# Altium schematic sheet V1_pwr_sply_sch.SchDoc
size A4; SheetNumber: 3; SheetTotal: 6; SPICEModelCacheFDQRRNLS: <root> / <DocumentId>FDQRRNLS</DocumentId> / <CacheFrame Number="0"> / <Model Name="875115552001_68uf" Kind="CKT"> / <Text>******* / .subckt 875115552001_68uF 1 2 / Rser 1 3 0.0109015046691 / Lser 2 4 4.507783507E-09 / C1 3 4 0.000068 / Rpar 3 4 73529.4117647059 / .ends 875115552001_68uF</Text> / </Model> / <Model Name="0805_885012107018_4.7uf" Kind="CKT"> / <Text>******* / .subckt 0805_885012107018_4.7uF 1 2 / Rser 1 3 0.00349429730952 / Lser 2 4 2.52123218E-10 / C1 3 4 0.0000047 / Rpar 3 4 20000000 / .ends 0805_885012107018_4.7uF</Text> / </Model> / <Model Name="0805_885012207076_470nf" Kind="CKT"> / <Text>******* / .subckt 0805_885012207076_470nF 1 2 / Rser 1 3 0.00781019032257 / Lser 2 4 0.00000000049 / C1 3 4 0.00000047 / Rpar 3 4 1100000000 / .ends 0805_885012207076_470nF</Text> / </Model> / <Model Name="6060_74439346100_10u" Kind="CKT"> / <Text>******* / .subckt 6060_74439346100_10u 1 2 / Rp 1 2 9786 / Cp 1 2 8.192p / Rs 1 N3 0.0265 / L1 N3 2 9.539u / .ends 6060_74439346100_10u</Text> / </Model> / </CacheFrame> / </root>
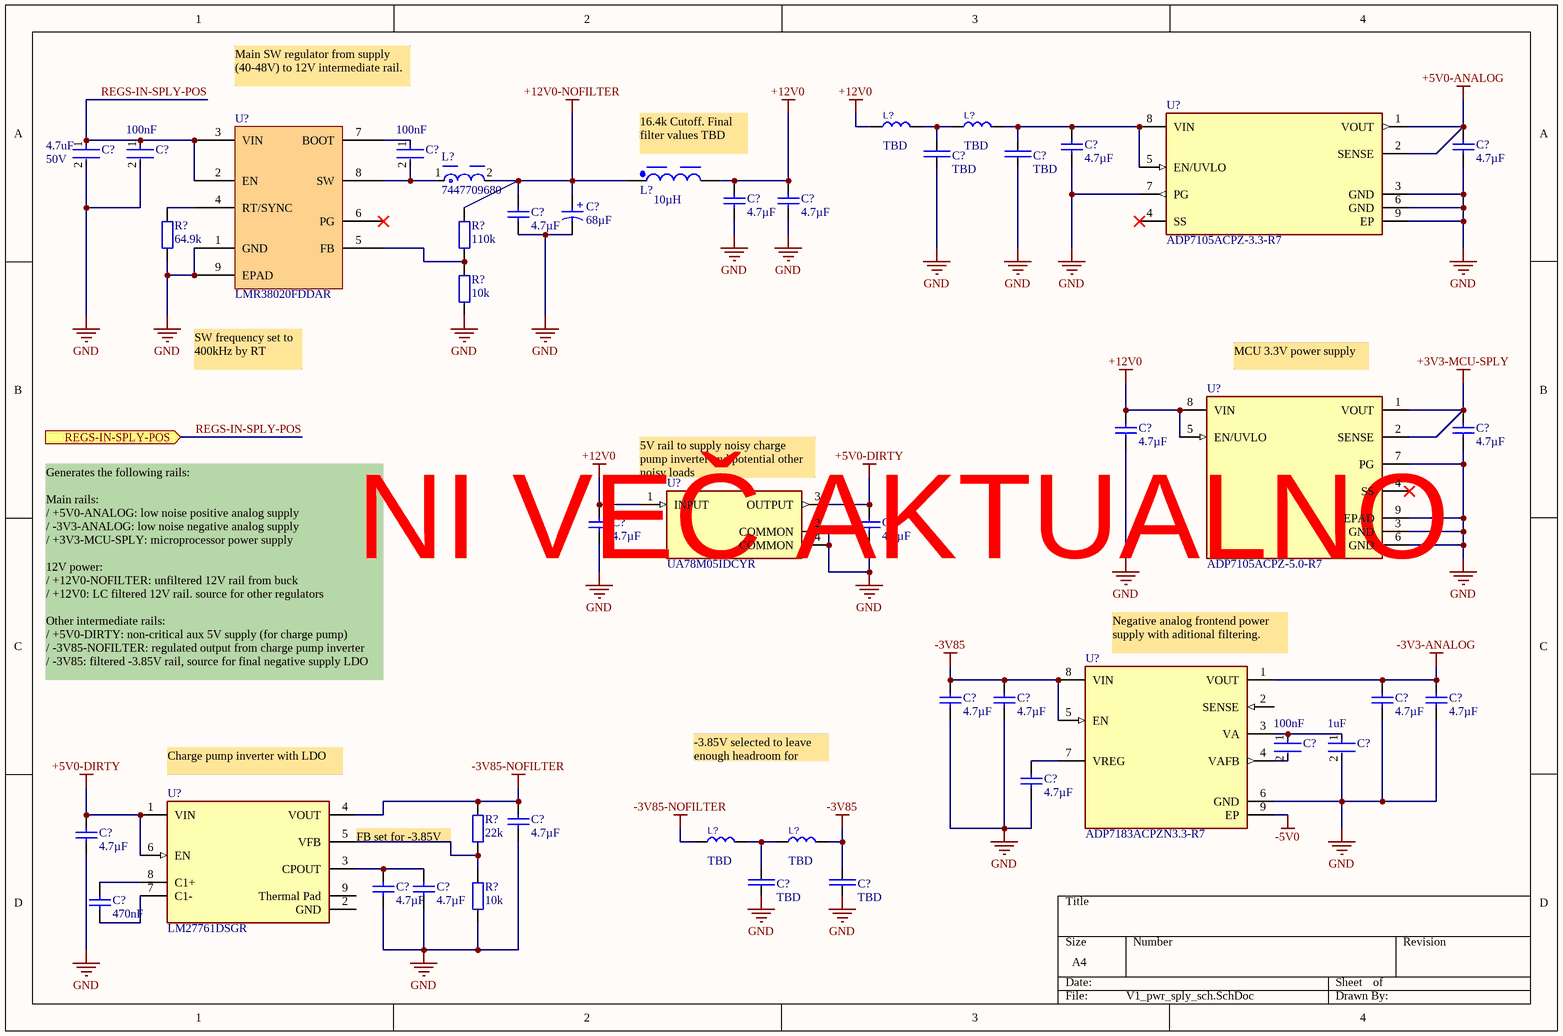
[diagram p0: V1_pwr_sply_sch.SchDoc]

## Parts
(Parts that share a designator on the sheet are numbered #1, #2 ... from top to bottom, then left to right.)
C?#1  Voltage Rating (DC): 50V  Capacitance: 4.7uF  [FP-885012208094-IPC_B]  (hidden comment: 885012208094)
C?#2  Capacitance: 100nF  [FP-885012206095-IPC_B]  (hidden comment: 885012206095)
C?#3  Capacitance: 100nF  [FP-885012206095-IPC_B]  (hidden comment: 885012206095)
C?#4  value TBD  [FPR_0603_C_R0]  (hidden comment: PN_C0603_TBD)
C?#5  value TBD  [FPR_0603_C_R0]  (hidden comment: PN_C0603_TBD)
C?#6  Capacitance: 4.7µF  [WCAP-CSGP_0805_L2W1.25H1.25]  (hidden comment: 885012107018)
C?#7  Capacitance: 4.7µF  [WCAP-CSGP_0805_L2W1.25H1.25]  (hidden comment: 885012107018)
C?#8  Capacitance: 68µF  [WCAP-PSHP_D8H8.7]  (hidden comment: 875115552001)
C?#9  Capacitance: 4.7µF  [WCAP-CSGP_0805_L2W1.25H1.25]  (hidden comment: 885012107018)
C?#10  Capacitance: 4.7µF  [WCAP-CSGP_0805_L2W1.25H1.25]  (hidden comment: 885012107018)
C?#11  Capacitance: 4.7µF  [WCAP-CSGP_0805_L2W1.25H1.25]  (hidden comment: 885012107018)
C?#12  Capacitance: 4.7µF  [WCAP-CSGP_0805_L2W1.25H1.25]  (hidden comment: 885012107018)
C?#13  Capacitance: 4.7µF  [WCAP-CSGP_0805_L2W1.25H1.25]  (hidden comment: 885012107018)
C?#14  Capacitance: 4.7µF  [WCAP-CSGP_0805_L2W1.25H1.25]  (hidden comment: 885012107018)
C?#15  Capacitance: 4.7µF  [WCAP-CSGP_0805_L2W1.25H1.25]  (hidden comment: 885012107018)
C?#16  Capacitance: 4.7µF  [WCAP-CSGP_0805_L2W1.25H1.25]  (hidden comment: 885012107018)
C?#17  Capacitance: 4.7µF  [WCAP-CSGP_0805_L2W1.25H1.25]  (hidden comment: 885012107018)
C?#18  Capacitance: 4.7µF  [WCAP-CSGP_0805_L2W1.25H1.25]  (hidden comment: 885012107018)
C?#19  Capacitance: 4.7µF  [WCAP-CSGP_0805_L2W1.25H1.25]  (hidden comment: 885012107018)
C?#20  Capacitance: 100nF  [FP-885012206095-IPC_B]  (hidden comment: 885012206095)
C?#21  Capacitance: 1uF  [FP-885012207078-IPC_B]  (hidden comment: 885012207078)
C?#22  Capacitance: 4.7µF  [WCAP-CSGP_0805_L2W1.25H1.25]  (hidden comment: 885012107018)
C?#23  Capacitance: 4.7µF  [WCAP-CSGP_0805_L2W1.25H1.25]  (hidden comment: 885012107018)
C?#24  Capacitance: 4.7µF  [WCAP-CSGP_0805_L2W1.25H1.25]  (hidden comment: 885012107018)
C?#25  value TBD  [FPR_0603_C_R0]  (hidden comment: PN_C0603_TBD)
C?#26  value TBD  [FPR_0603_C_R0]  (hidden comment: PN_C0603_TBD)
C?#27  Capacitance: 4.7µF  [WCAP-CSGP_0805_L2W1.25H1.25]  (hidden comment: 885012107018)
C?#28  Capacitance: 4.7µF  [WCAP-CSGP_0805_L2W1.25H1.25]  (hidden comment: 885012107018)
C?#29  Capacitance: 470nF  [WCAP-CSGP_0805_L2W1.25H1.25]  (hidden comment: 885012207076)
L?#1  value TBD  (hidden comment: PN_L0805_TBD)
L?#2  value TBD  (hidden comment: PN_L0805_TBD)
L?#3  7447709680  [FP-7447709680-MFG]
L?#4  Inductance: 10µH  [WE-XHMI_6060_L6.65W6.45H5.8]  (hidden comment: 10µH, 5A)
L?#5  value TBD  (hidden comment: PN_L0805_TBD)
L?#6  value TBD  (hidden comment: PN_L0805_TBD)
R?#1  value 64.9k  [FPR_0603_R_R0]  (hidden comment: PN_R0603_64k9)
R?#2  value 110k  [FPR_0603_R_R0]  (hidden comment: PN_R0603_110k)
R?#3  value 10k  [FPR_0603_R_R0]  (hidden comment: PN_R0603_10k)
R?#4  value 22k  [FPR_0603_R_R0]  (hidden comment: PN_R0603_22k)
R?#5  value 10k  [FPR_0603_R_R0]  (hidden comment: PN_R0603_10k)
U?#1  ADP7105ACPZ-3.3-R7  [FP-CP-8-5-IPC_C]
U?#2  LMR38020FDDAR
U?#3  ADP7105ACPZ-5.0-R7  [FP-CP-8-5-IPC_B]
U?#4  UA78M05IDCYR  [FP-DCY0004A-MFG]
U?#5  ADP7183ACPZN3.3-R7  [FP-CP-8-27-IPC_B]
U?#6  LM27761DSGR  [FP-DSG0008A-IPC_B]

## Ports
REGS-IN-SPLY-POS (in)

## Nets
+3V3-MCU-SPLY: C?#13.2 U?#3.1(VOUT) U?#3.2(SENSE)
+5V0-ANALOG: C?#7.2 U?#1.1(VOUT) U?#1.2(SENSE)
+5V0-DIRTY: C?#15.2 C?#24.2 U?#4.3(OUTPUT) U?#6.1(VIN) U?#6.6(EN)
+12V0: C?#9.2 C?#10.2 C?#12.2 C?#14.2 L?#1.1 L?#4.2 U?#3.5(EN/UVLO) U?#3.8(VIN) U?#4.1(INPUT)
+12V0-NOFILTER: C?#8.1(P) C?#11.2 L?#3.2 L?#4.1 R?#2.2
-3V3-ANALOG: C?#18.2 C?#19.2 U?#5.1(VOUT)
-3V85: C?#16.2 C?#17.2 C?#26.1 L?#6.2 U?#5.5(EN) U?#5.8(VIN)
-3V85-NOFILTER: C?#22.1 L?#5.1 R?#4.2 U?#6.4(VOUT)
-5V0: U?#5.9(EP)
GND: C?#1.2 C?#2.2 C?#4.1 C?#5.1 C?#6.1 C?#7.1 C?#8.2(N) C?#9.1 C?#10.1 C?#11.1 C?#12.1 C?#13.1 C?#14.1 C?#15.1 C?#16.1 C?#17.1 C?#18.1 C?#19.1 C?#21.2 C?#22.2 C?#23.1 C?#24.1 C?#25.2 C?#26.2 C?#27.1 C?#28.1 R?#1.1 R?#3.1 R?#5.1 U?#1.3(GND) U?#1.6(GND) U?#1.7(PG) U?#1.9(EP) U?#2.1(GND) U?#2.9(EPAD) U?#3.3(GND) U?#3.6(GND) U?#3.7(PG) U?#3.9(EPAD) U?#4.2(COMMON) U?#4.4(COMMON) U?#5.6(GND)
REGS-IN-SPLY-POS: C?#1.1 C?#2.1 U?#2.2(EN) U?#2.3(VIN) ; port REGS-IN-SPLY-POS
NetC?#3_1: C?#3.1 U?#2.7(BOOT)
NetC?#3_2: C?#3.2 L?#3.1 U?#2.8(SW)
NetC?#4_2: C?#4.2 L?#1.2 L?#2.1
NetC?#5_2: C?#5.2 C?#6.2 L?#2.2 U?#1.5(EN/UVLO) U?#1.8(VIN)
NetC?#20_1: C?#20.1 C?#21.1 U?#5.3(VA)
NetC?#20_2: C?#20.2 U?#5.4(VAFB)
NetC?#23_2: C?#23.2 U?#5.7(VREG)
NetC?#25_1: C?#25.1 L?#5.2 L?#6.1
NetC?#27_2: C?#27.2 C?#28.2 U?#6.3(CPOUT)
NetC?#29_1: C?#29.1 U?#6.7(C1-)
NetC?#29_2: C?#29.2 U?#6.8(C1+)
NetR?#1_2: R?#1.2 U?#2.4(RT/SYNC)
NetR?#2_1: R?#2.1 R?#3.2 U?#2.5(FB)
NetR?#4_1: R?#4.1 R?#5.2 U?#6.5(VFB)

Not connected (* = marked no-connect by the designer): U?#1 4(SS)*; U?#2 6(PG)*; U?#3 4(SS)*; U?#5 2(SENSE); U?#6 2(GND) 9(Thermal_Pad)

## Notes on the sheet
- Main SW regulator from supply (40-48V) to 12V intermediate rail.
- 16.4k Cutoff. Final filter values TBD
- SW frequency set to 400kHz by RT
- (near U?#3) MCU 3.3V power supply
- (near U?#3) NI VEČ AKTUALNO
- (near U?#4) 5V rail to supply noisy charge pump inverter and potential other noisy loads
- (near U?#5) Negative analog frontend power supply with aditional filtering.
- Generates the following rails:
  Main rails:
  / +5V0-ANALOG: low noise positive analog supply
  / -3V3-ANALOG: low noise negative analog supply
  / +3V3-MCU-SPLY: microprocessor power supply
  12V power:
  / +12V0-NOFILTER: unfiltered 12V rail from buck
  / +12V0: LC filtered 12V rail. source for other regulators
  Other intermediate rails:
  / +5V0-DIRTY: non-critical aux 5V supply (for charge pump)
  / -3V85-NOFILTER: regulated output from charge pump inverter
  / -3V85: filtered -3.85V rail, source for final negative supply LDO
- (near U?#6) Charge pump inverter with LDO
- -3.85V selected to leave enough headroom for charge pump LDO an -3.3V LDO
- FB set for -3.85V out
- (in symbol 875115552001) +

## Library data of the parts
C?#1 = CMP-207839-000019-1: CAP CER 4.7UF 50V X7R 1206; Tolerance: 10%; Mount: Surface Mount; Width: 0.063inch; Min Operating Temperature: -55°C; RoHS Compliant: Yes; Dielectric: X7R; Series: WCAP-CSGP; Case Code (Metric): 3216; Case/Package: 1206; Max Operating Temperature: 125°C; Thickness: 0.075inch; Packaging: Cut Tape; Length: 0.126inch; Voltage Rating: 50V; Case Code (Imperial): 1206
C?#2 C?#3 C?#20 = CMP-207839-000004-1: CAP CER 0.1UF 50V X7R 0603; Tolerance: 10%; RoHS Compliant: Yes; Thickness: 0.037inch; Voltage Rating: 50V; Packaging: Cut Tape; Dielectric: X7R; Series: WCAP-CSGP; Width: 0.031inch; Max Operating Temperature: 125°C; Min Operating Temperature: -55°C; Case/Package: 0603; Case Code (Metric): 1608; Case Code (Imperial): 0603; Length: 0.063inch; Mount: Surface Mount; Voltage Rating (DC): 50V
C?#4 C?#5 C?#25 C?#26 = C: Capacitor - generic SMD
C?#6 C?#7 C?#9-C?#19 C?#22-C?#24 C?#27 C?#28 = 885012107018: WCAP-CSGP Multilayer Ceramic Chip Capacitor, General Purpose, size 0805, X5R, 4.7µF, 25VDC; Manufacturer: Wurth Elektronik; Case/Size Code: 0805; Capacitance Tolerance: +/-20%; Dissipation Factor: 10%; Insulation Resistance: 0.02GΩ; Rated Voltage (DC): 25V; Technical Reference: X5R0805475M025DFCT10000; Manufacturer Part Number: 885012107018; Category: Multilayer Ceramic Chip Capacitors; Match Code: WCAP-CSGP; ComponentLink1Description: Website Link; ComponentLink1URL: https://www.we-online.com/redexpert/article/885012107018?ad; ComponentLink2Description: Datasheet Link; ComponentLink2URL: https://www.we-online.com/redexpert/spec/885012107018?ad; Mount: Surface Mount; Operating Temperature Max: 85°C; Operating Temperature Min: -55°C; Packaging: Tape and Reel; Length: 2mm; Width: 1.25mm; Height: 1.25mm; Ceramic Type: X5R
C?#8 = 875115552001: WCAP-PSHP Aluminum Polymer Capacitor, V-Chip, SMT, D8 x H8.7mm, 68µF, 25V; Manufacturer: Wurth Elektronik; Capacitance Tolerance: +/-20%; Dissipation Factor: 8%; Endurance: 2000h; ESR: 20mΩ; Leakage Current: 340µA; Ripple Current: 3500mA; Technical Reference: PSEE087680M025DVCTEB000; Manufacturer Part Number: 875115552001; Category: Aluminum Polymer Capacitors; Match Code: WCAP-PSHP; ComponentLink1Description: Website Link; ComponentLink1URL: https://www.we-online.com/redexpert/article/875115552001?ad; ComponentLink2Description: Datasheet Link; ComponentLink2URL: https://www.we-online.com/redexpert/spec/875115552001?ad; Mount: Surface Mount; Operating Temperature Max: 105°C; Operating Temperature Min: -55°C; Packaging: Tape and Reel; Height: 8.7mm; Diameter: 8mm; Rated Voltage (DC): 25V
C?#21 = CMP-207839-000010-1: CAP CER 1UF 25V X7R 0805; Tolerance: 10%; Series: WCAP-CSGP; Mount: Surface Mount; RoHS Compliant: Yes; Case Code (Metric): 2012; Width: 0.049inch; Thickness: 0.053inch; Dielectric: X7R; Max Operating Temperature: 125°C; Case Code (Imperial): 0805; Case/Package: 0805; Length: 0.079inch; Voltage Rating: 25V; Packaging: Cut Tape; Min Operating Temperature: -55°C; Voltage Rating (DC): 25V
C?#29 = 885012207076: WCAP-CSGP Multilayer Ceramic Chip Capacitor, General Purpose, size 0805, X7R, 470nF, 25VDC; Manufacturer: Wurth Elektronik; Case/Size Code: 0805; Capacitance Tolerance: +/-10%; Dissipation Factor: 3.5%; Insulation Resistance: 1.1GΩ; Rated Voltage (DC): 25V; Technical Reference: X7R0805474K025DFCT10000; Manufacturer Part Number: 885012207076; Category: Multilayer Ceramic Chip Capacitors; Match Code: WCAP-CSGP; ComponentLink1Description: Website Link; ComponentLink1URL: https://www.we-online.com/redexpert/article/885012207076?ad; ComponentLink2Description: Datasheet Link; ComponentLink2URL: https://www.we-online.com/redexpert/spec/885012207076?ad; Mount: Surface Mount; Operating Temperature Max: 125°C; Operating Temperature Min: -55°C; Packaging: Tape and Reel; Length: 2mm; Width: 1.25mm; Height: 1.25mm; Ceramic Type: X7R
L?#1 L?#2 L?#5 L?#6 = L: Inductor - generic SMD
L?#3 = CMP-0227-00181-2: FIXED IND 68UH 3.2A 89 MOHM SMD; Tolerance: 20%; Test Frequency: 1kHz; Series Resistance: 89mR; Inductor Type: POWER; Shielding: Shielded; Saturation Current: 3.6A; Core Material: Ferrite; Self Resonant Frequency: 6MHz; Depth: 12mm; Weight: 0.01lb; Max Operating Temperature: 125°C; Width: 12mm; RoHS Compliant: Yes; Length: 12mm; Termination: SMD/SMT; Series: WE-PD; Package Quantity: 1; Ratings: AEC-Q200; DC Resistance (DCR): 89mR; Number of Pins: 2; Lead Free: Lead Free; Height: 10mm; Resistance: 89mR; Case Code (Imperial): 1210; Inductance: 68uH; Min Operating Temperature: -40°C; Case Code (Metric): 3225; Mount: Surface Mount; Resistor Type: Wirewound; RMS Current (Irms): 3.2A; Case/Package: 1210; Height - Seated (Max): 0.394inch; Max DC Current: 3.2A; Packaging: Cut Tape; Current Rating: 3.2A; Inductance Tolerance: 20%
L?#4 = 74439346100: WE-XHMI SMT Power Inductor, size 6060, 10µH, 5A, 26.5mΩ; Manufacturer: Wurth Elektronik; Case/Size Code: 6060; Performance Rated Current: 6.4A; Saturation Current: 9.7A; Self Resonant Frequency: 18MHz; Manufacturer Part Number: 74439346100; Category: Shielded Power Inductors; Match Code: WE-XHMI; ComponentLink1Description: Website Link; ComponentLink1URL: https://www.we-online.com/redexpert/article/74439346100?ad; ComponentLink2Description: Datasheet Link; ComponentLink2URL: https://www.we-online.com/redexpert/spec/74439346100?ad; Mount: Surface Mount; Operating Temperature Max: 125°C; Operating Temperature Min: -40°C; Packaging: Tape and Reel; Length: 6.65mm; Width: 6.45mm; Height: 5.8mm; DC Resistance: 26.5mΩ; Rated Current: 5A
R?#1-R?#5 = R: Resistor - generic SMD
U?#1 = CMP-09138-000177-1: IC REG LINEAR 3.3V 500MA 8LFCSP; Max Input Voltage: 20V; Max Output Voltage: 19V; Power Supply Rejection Ratio (PSRR): 50dB; Max Supply Current: 900uA; Min Output Voltage: 1.22V; Max Operating Temperature: 125°C; Min Operating Temperature: -40°C; RoHS Compliant: Yes; Min Input Voltage: 3.3V; Max Output Current: 500mA; Number of Pins: 8
U?#2 = LMR38020: LMR38020 SIMPLE SWITCHER® 4.2-V to 80-V, 2-A Synchronous Buck Converter with 40-µA IQ
U?#3 = CMP-09138-000117-1: IC REG LINEAR 5V 500MA 8LFCSP; Polarity: Positive; Power Supply Rejection Ratio (PSRR): 50dB; Min Output Voltage: 1.22V; Quiescent Current: 900uA; Number of Regulators: 1; Min Input Voltage: 3.3V; Dropout Voltage: 350mV; Min Current Limit: 625mA; Max Input Voltage: 20V; Reference Voltage: 1.23V; Operating Supply Current: 900mA; Max Output Voltage: 19V; Output Type: Fixed; Accuracy: 0.8%; Output Current: 500mA; Max Output Current: 500mA; Number of Outputs: 1; Max Supply Current: 900uA; Number of Pins: 8; Output Voltage: 5V; Package Quantity: 1500; RoHS Compliant: Yes; Lead Free: Contains Lead; Packaging: Tape and Reel; Max Operating Temperature: 125°C; Mount: Surface Mount; Min Operating Temperature: -40°C; Contact Plating: Tin
U?#4 = CMP-04917-000030-1: IC REG LINEAR 5V 500MA SOT223-4; Manufacturer: Texas Instruments; Min Supply Voltage: 7V; Number Of Outputs: 1; Dropout Voltage: 2V; Max Supply Voltage: 25V; Output Type: Fixed; Max Junction Temp: +125°C; Standoff Height: 0.02mm; Automotive: No; Temperature Range Low: -40°C; Temperature Range High: +125°C; Package: DCY0004A; Lead Free: Yes; Octopart: https://octopart.com/ua78m05idcyr-texas+instruments-525575; Output Current: 500mA; ComponentLink2URL: http://www.ti.com/lit/ds/symlink/ua78m.pdf; Mouser Description: Linear Voltage Regulators 5V 500mA Fixed Pos Voltage Regulator; Device Class L1: Integrated Circuits (ICs); Device Class L3: Voltage Regulators - Linear; RoHS: TRUE; ComponentLink2Description: Datasheet; Output Voltage: 5V; Height: 1.8mm; Temperature: -40°C to +125°C; Manufacturer Part Number: UA78M05IDCYR; Digikey Description: IC REG LINEAR 5V 500MA SOT223-4; Category: IC; Device Class L2: Power Management ICs; Ipc Land Pattern Name: SOT230P700X180-4
U?#5 = CMP-09138-000105-1: IC REG LINEAR -3.3V 300MA 8LFCSP; Output Configuration: Negative; Max Input Voltage: -5.5V; Max Supply Current: 7mA; Quiescent Current: 900uA; Power Supply Rejection Ratio (PSRR): 40dB; Number of Regulators: 1; Output Type: Fixed; Dropout Voltage: 220mV; Output Current: 300mA; Packaging: Cut Tape; Min Operating Temperature: -40°C; Min Output Voltage: -3.3V; Number of Pins: 8; Max Operating Temperature: 125°C; RoHS Compliant: Yes; Mount: Surface Mount; Part Number: ADP7183ACPZN3.3-R7
U?#6 = CMP-04918-000003-1: IC REG SWITCHD CAP NEG ADJ 8WSON; Manufacturer: Texas Instruments; Min Supply Voltage: 2.7V; Negative Voltage Available: true; Switching Topology: Charge Pump; Switching Frequency: 2MHz; Max Junction Temp: +125°C; Number Of Outputs: 1; Standoff Height: 0mm; Nominal Supply Current: 370uA; Output Voltage: -1.5-5V; Output Current: 250mA; Output Type: AdjustableProgrammable; Max Supply Voltage: 5.5V; Ambient Temperature Range High: +85°C; Temperature Range High: +85°C; Octopart: https://octopart.com/lm27761dsgr-texas+instruments-66646293; Lead Free: Yes; Digikey Description: IC REG SWITCHD CAP NEG ADJ 8WSON; Category: IC; Ambient Temperature Range Low: -40°C; Mouser Description: Low-Noise Regulated Inverter with Integrated LDO 8-WSON -40 to 85; Manufacturer Part Number: LM27761DSGR; ComponentLink2Description: Datasheet; ComponentLink2URL: http://www.ti.com/lit/ds/symlink/lm27761.pdf; Device Class L2: Power Management ICs; RoHS: TRUE; Device Class L3: Voltage Regulators - Switching; Automotive: No; Height: 0.8mm; Temperature: -40°C to +85°C; Device Class L1: Integrated Circuits (ICs); Package: DSG0008A; Temperature Range Low: -40°C